# EAGLE schematic growmat_easy (EAGLE 7.5.0)

## Sheet 1 of 2
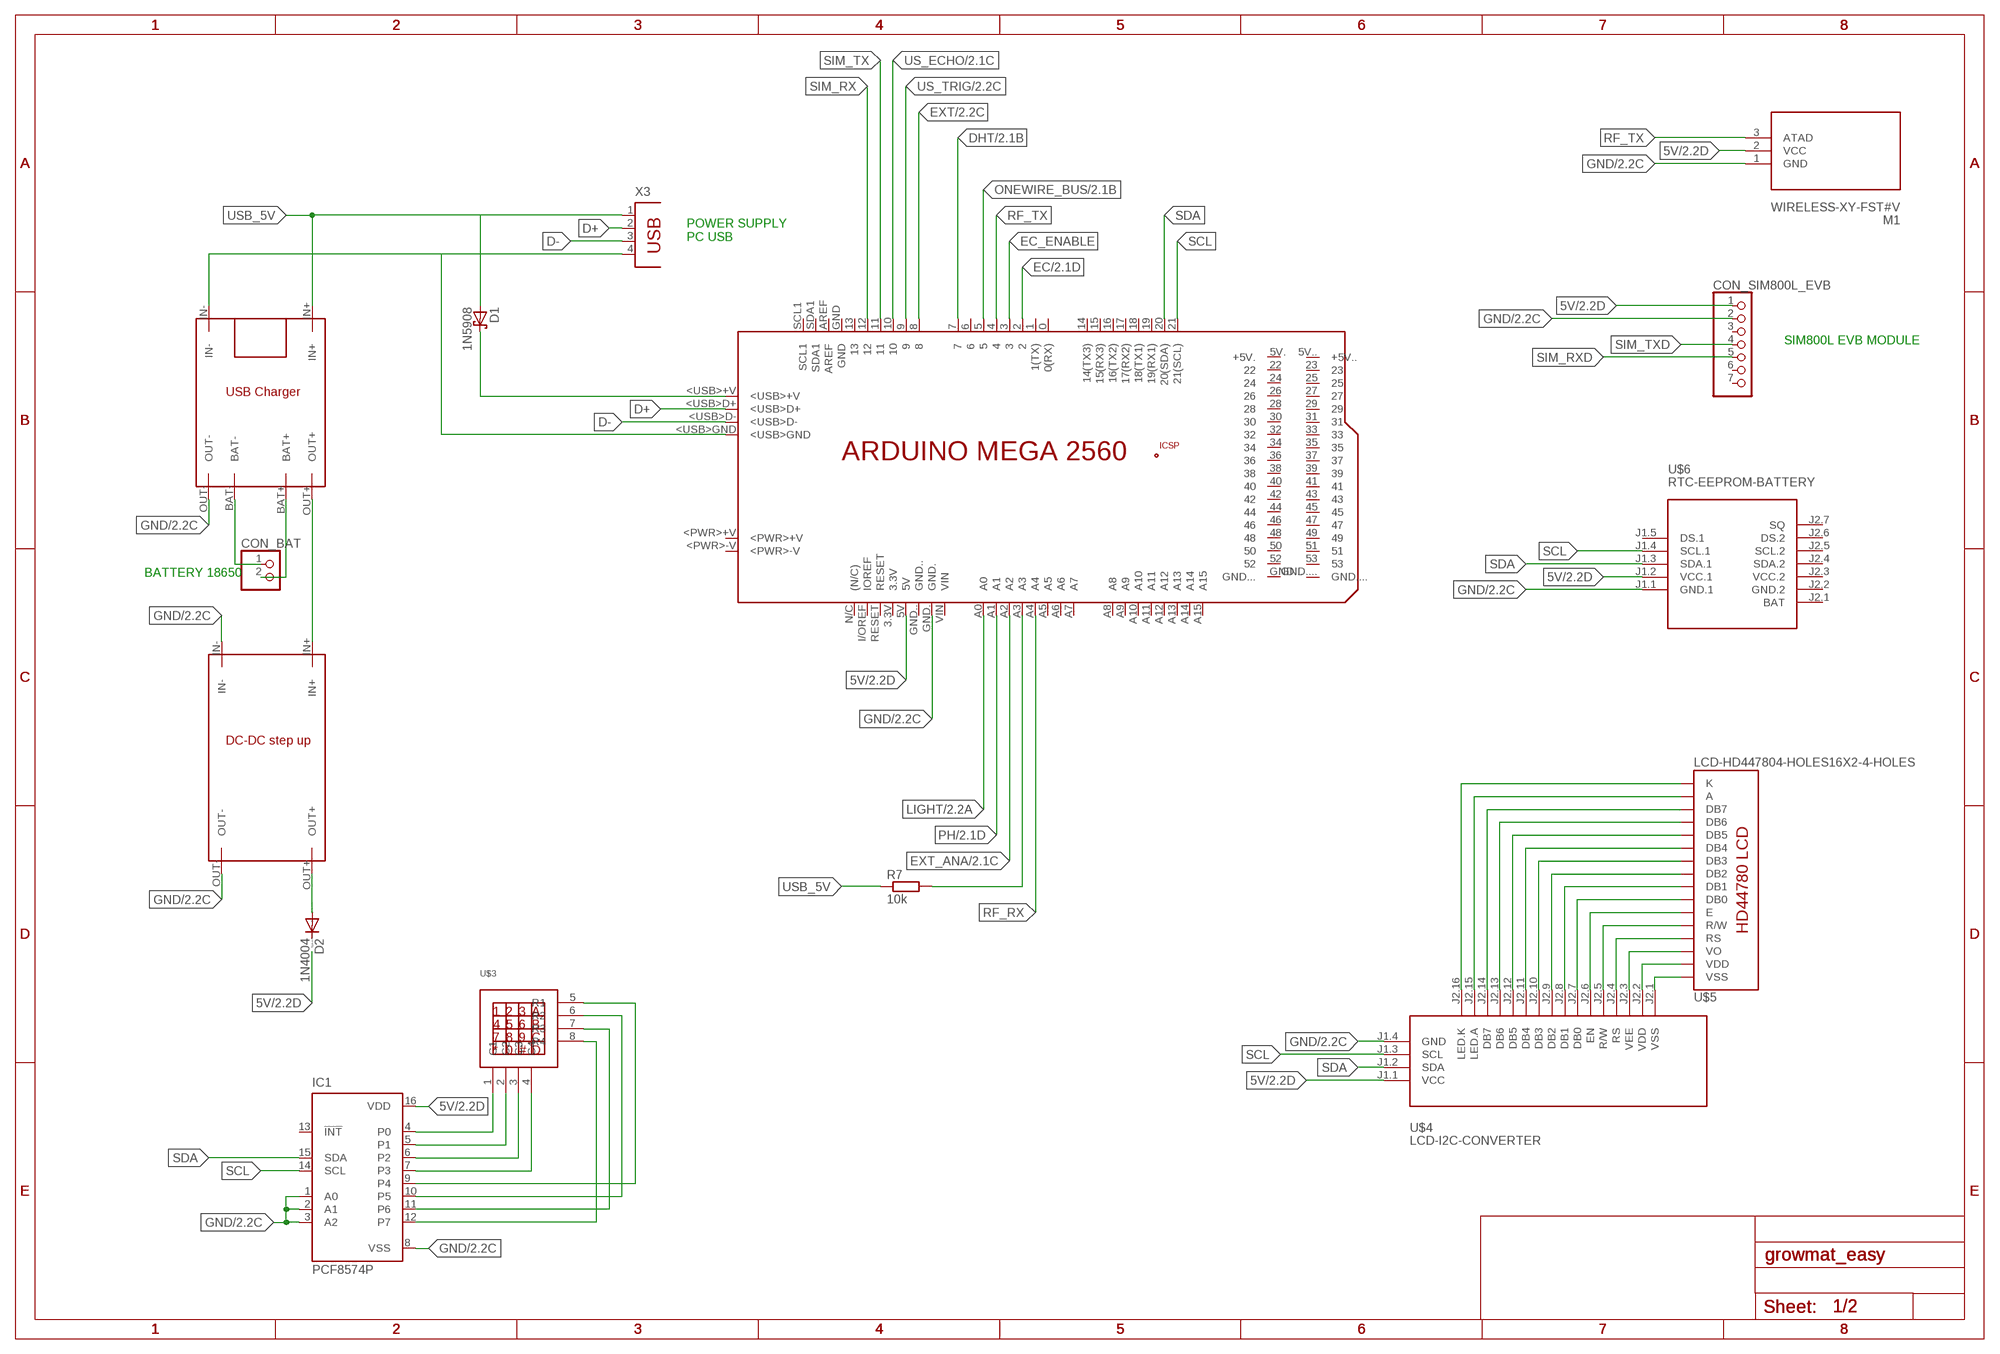
[diagram p0: schematic, sheet 1]

### Parts
CON_BAT  PINHD-1X2  [1X02]
CON_SIM800L_EVB  PINHD-1X7  [1X07]
D1  1N5908  [C4111-15]
D2  1N4004  [DO41-10]
IC1  PCF8574P  [DIL16]
M1  WIRELESS-XY-FST#V  [WIRELESS-XY-FST#V]
PCB1  ARDUINO_MEGA2560  [ARDUINO_MEGA2560]
R7  10k  R-EU_0309/12  [0309/12]
U$1  TP4056  [TP4056]
U$2  DC-DC_STEPUP  [DC-DC_STEPUP]
U$3  KEYPAD4X4  [KEYPAD4X4]
U$4  LCD-I2C-CONVERTER  [LCD-I2C-CONVERTER]
U$5  LCD-HD447804-HOLES16X2-4-HOLES  [LCD-16X2-4HOLES]
U$6  RTC-EEPROM-BATTERY  [RTC_EEPROM_BATTERY]
X3  PN61729  [PN61729]

### Nets
5V: CON_SIM800L_EVB.1 IC1.16(VDD) M1.2(VCC) PCB1.5V U$4.J1.1(VCC) U$6.J1.2(VCC.1) ; also sheet 2
BAT+: CON_BAT.2 U$1.BAT+
BAT-: CON_BAT.1 U$1.BAT-
D+: PCB1.<USB>D+ X3.2
D-: PCB1.<USB>D- X3.3
DHT: PCB1.7 ; also sheet 2
EC: PCB1.2 ; also sheet 2
EC_ENABLE: PCB1.3
EXT: PCB1.8 ; also sheet 2
EXT_ANA: PCB1.A2 ; also sheet 2
GND: CON_SIM800L_EVB.2 IC1.1(A0) IC1.2(A1) IC1.3(A2) IC1.8(VSS) M1.1(GND) PCB1.GND. U$1.OUT- U$2.IN- U$2.OUT- U$4.J1.4(GND) U$6.J1.1(GND.1) ; also sheet 2
LIGHT: PCB1.A0 ; also sheet 2
N$1: U$1.OUT+ U$2.IN+
N$2: PCB1.<USB>GND U$1.IN- X3.4
N$3: IC1.4(P0) U$3.1(C1)
N$4: IC1.5(P1) U$3.2(C2)
N$6: IC1.6(P2) U$3.3(C3)
N$7: D1.C PCB1.<USB>+V
N$8: IC1.7(P3) U$3.4(C4)
N$9: IC1.9(P4) U$3.5(R1)
N$10: IC1.10(P5) U$3.6(R2)
N$11: IC1.11(P6) U$3.7(R3)
N$12: IC1.12(P7) U$3.8(R4)
N$13: U$4.J2.1(VSS) U$5.1(VSS)
N$14: U$4.J2.2(VDD) U$5.2(VDD)
N$15: U$4.J2.3(VEE) U$5.3(VO)
N$16: U$4.J2.4(RS) U$5.4(RS)
N$17: U$4.J2.5(R/W) U$5.5(R/W)
N$18: U$4.J2.6(EN) U$5.6(E)
N$19: U$4.J2.7(DB0) U$5.7(DB0)
N$20: U$4.J2.8(DB1) U$5.8(DB1)
N$21: U$4.J2.9(DB2) U$5.9(DB2)
N$22: U$4.J2.10(DB3) U$5.10(DB3)
N$23: U$4.J2.11(DB4) U$5.11(DB4)
N$24: U$4.J2.12(DB5) U$5.12(DB5)
N$25: U$4.J2.13(DB6) U$5.13(DB6)
N$26: U$4.J2.14(DB7) U$5.14(DB7)
N$27: U$4.J2.15(LED.A) U$5.15(A)
N$28: U$4.J2.16(LED.K) U$5.16(K)
N$35: PCB1.A3 R7.2
N$36: D2.A U$2.OUT+
ONEWIRE_BUS: PCB1.5 ; also sheet 2
PH: PCB1.A1 ; also sheet 2
RF_RX: PCB1.A4
RF_TX: M1.3(ATAD) PCB1.4
SCL: IC1.14(SCL) PCB1.21(21(SCL)) U$4.J1.3(SCL) U$6.J1.4(SCL.1)
SDA: IC1.15(SDA) PCB1.20(20(SDA)) U$4.J1.2(SDA) U$6.J1.3(SDA.1)
SIM_RX: PCB1.12
SIM_RXD: CON_SIM800L_EVB.5
SIM_TX: PCB1.11
SIM_TXD: CON_SIM800L_EVB.4
US_ECHO: PCB1.10 ; also sheet 2
US_TRIG: PCB1.9 ; also sheet 2
USB_5V: D1.A R7.1 U$1.IN+ X3.1
Unconnected: CON_SIM800L_EVB.3 CON_SIM800L_EVB.6 CON_SIM800L_EVB.7 D2.C IC1.13(!INT) PCB1.0(0(RX)) PCB1.1(1(TX)) PCB1.3.3V PCB1.5V.(+5V.) PCB1.5V..(+5V..) PCB1.6 PCB1.13 PCB1.14(14(TX3)) PCB1.15(15(RX3)) PCB1.16(16(TX2)) PCB1.17(17(RX2)) PCB1.18(18(TX1)) PCB1.19(19(RX1)) PCB1.22 PCB1.23 PCB1.24 PCB1.25 PCB1.26 PCB1.27 PCB1.28 PCB1.29 PCB1.30 PCB1.31 PCB1.32 PCB1.33 PCB1.34 PCB1.35 PCB1.36 PCB1.37 PCB1.38 PCB1.39 PCB1.40 PCB1.41 PCB1.42 PCB1.43 PCB1.44 PCB1.45 PCB1.46 PCB1.47 PCB1.48 PCB1.49 PCB1.50 PCB1.51 PCB1.52 PCB1.53 PCB1.+5V_ PCB1.<PWR>+V PCB1.<PWR>-V PCB1.A5 PCB1.A6 PCB1.A7 PCB1.A8 PCB1.A9 PCB1.A10 PCB1.A11 PCB1.A12 PCB1.A13 PCB1.A14 PCB1.A15 PCB1.AREF PCB1.GND PCB1.GND.. PCB1.GND... PCB1.GND.... PCB1.GND__ PCB1.I/OREF(IOREF) PCB1.MISO PCB1.MOSI PCB1.N/C((N/C)) PCB1.RESET PCB1.RESET. PCB1.SCK PCB1.SCL1 PCB1.SDA1 PCB1.VIN U$6.J1.5(DS.1) U$6.J2.1(BAT) U$6.J2.4(SDA.2) U$6.J2.5(SCL.2) U$6.J2.6(DS.2) U$6.J2.7(SQ)

### Notes on the sheet
- POWER SUPPLY
  PC USB
- SIM800L EVB MODULE
- BATTERY 18650

## Sheet 2 of 2
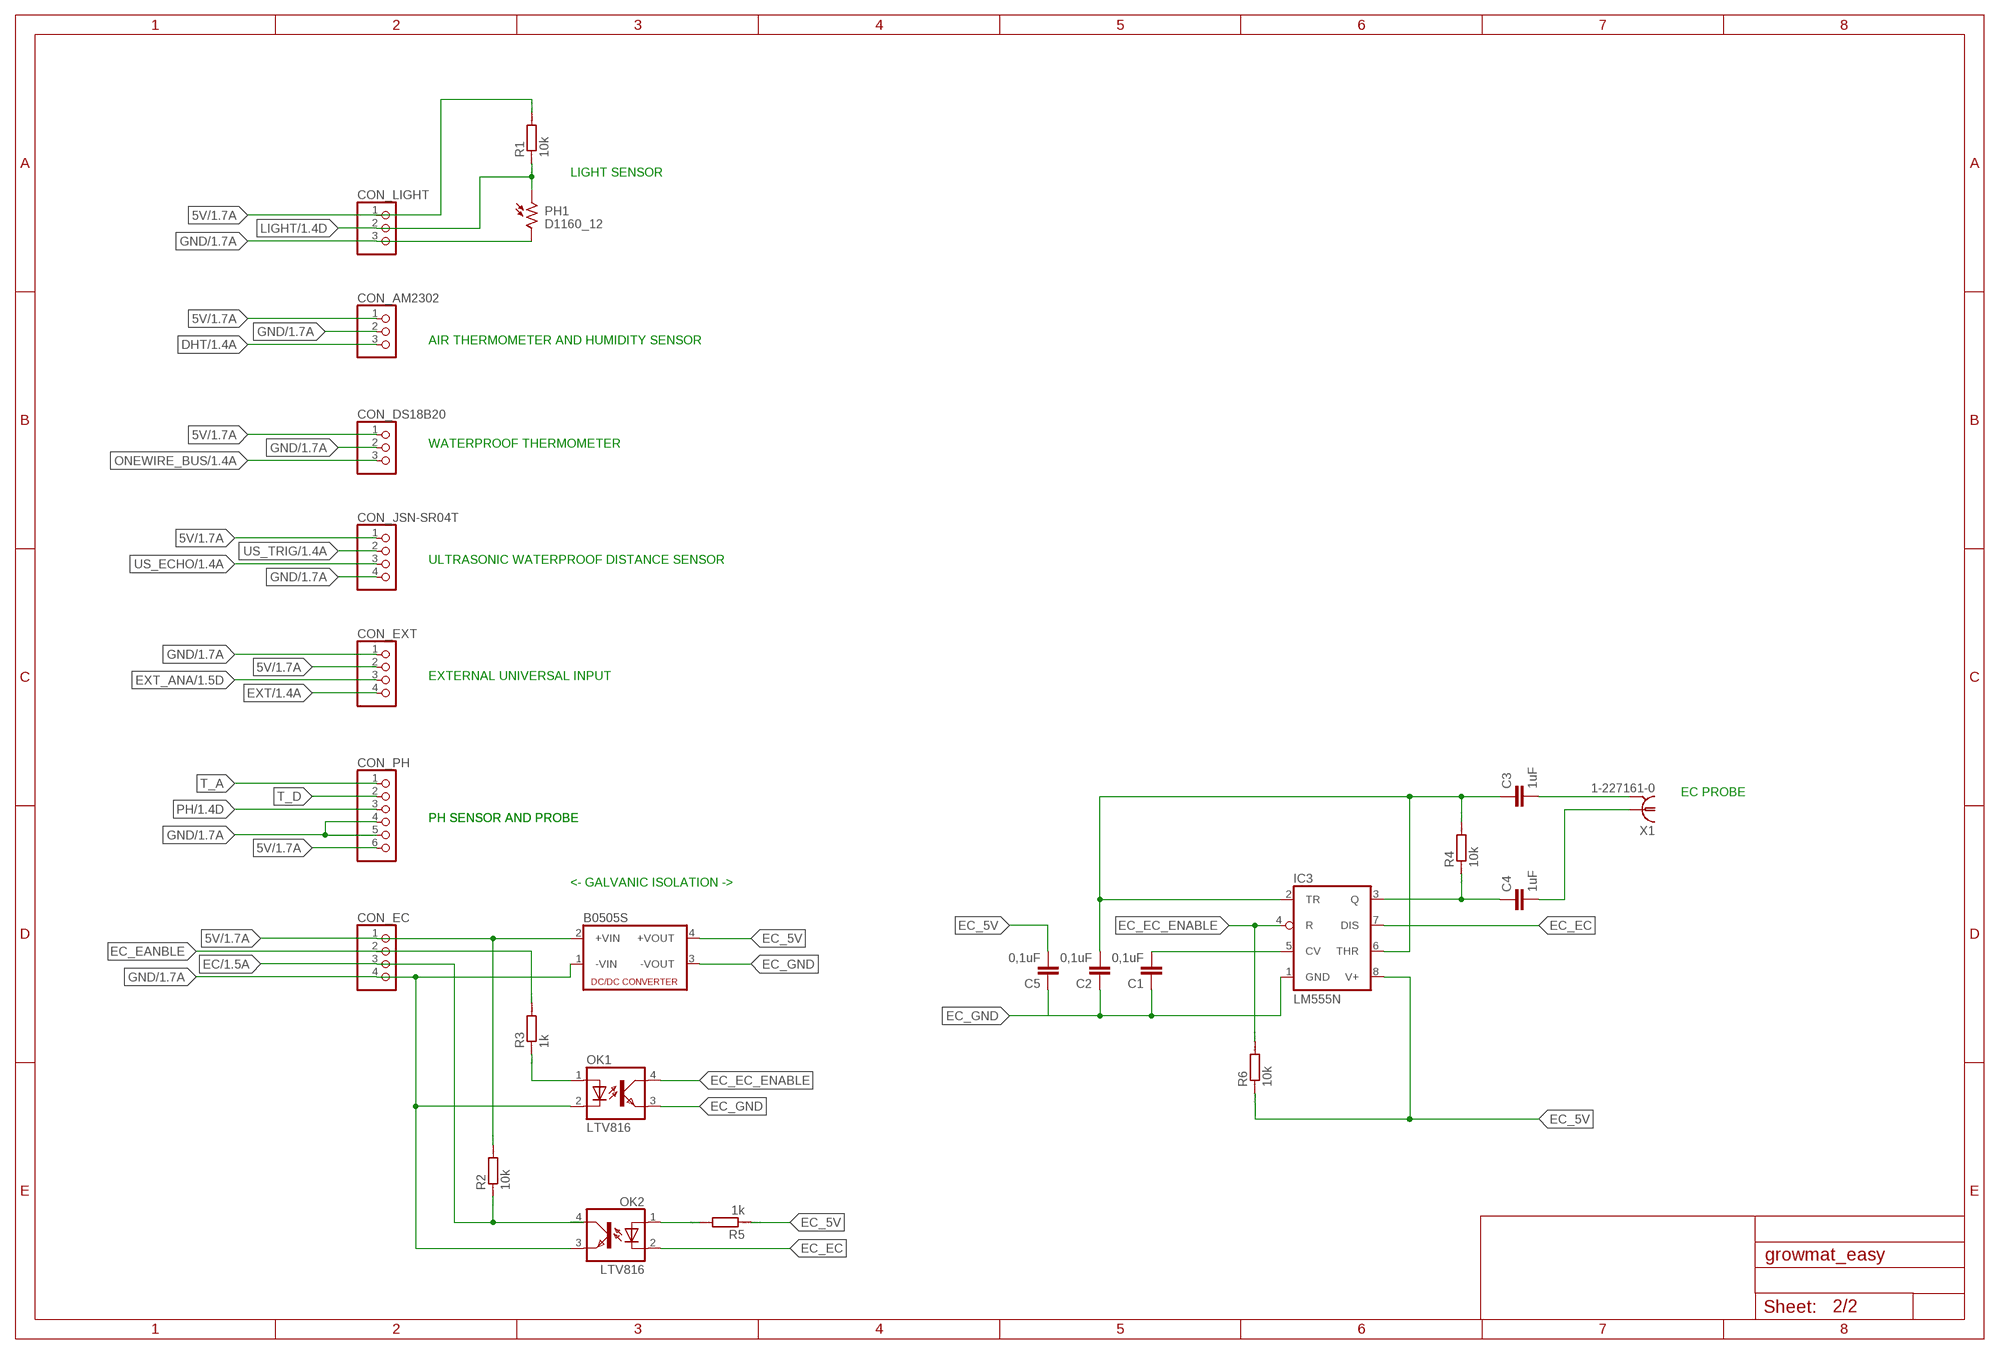
[diagram p1: schematic, sheet 2]

### Parts
B0505S  NME  [NME]
C1  0,1uF  C-EU050-024X044  [C050-024X044]
C2  0,1uF  C-EU050-024X044  [C050-024X044]
C3  1uF  C-EU050-024X044  [C050-024X044]
C4  1uF  C-EU050-024X044  [C050-024X044]
C5  0,1uF  C-EU050-024X044  [C050-024X044]
CON_AM2302  PINHD-1X3  [1X03]
CON_DS18B20  PINHD-1X3  [1X03]
CON_EC  PINHD-1X4  [1X04]
CON_EXT  PINHD-1X4  [1X04]
CON_JSN-SR04T  PINHD-1X4  [1X04]
CON_LIGHT  PINHD-1X3  [1X03]
CON_PH  PINHD-1X6  [1X06]
IC3  LM555N  [DIL08]
OK1  LTV816  [DIL04]
OK2  LTV816  [DIL04]
PH1  D1160_12  [D11XX]
R1  10k  R0207/10  [0207/10]
R2  10k  R0207/10  [0207/10]
R3  1k  R0207/10  [0207/10]
R4  10k  R0207/10  [0207/10]
R5  1k  R0207/10  [0207/10]
R6  10k  R0207/10  [0207/10]
X1  1-227161-0  [AMP_227161]

### Nets
5V: B0505S.2(+VIN) CON_AM2302.1 CON_DS18B20.1 CON_EC.1 CON_EXT.2 CON_JSN-SR04T.1 CON_PH.6 R1.2 R2.2 ; also sheet 1
DHT: CON_AM2302.3 ; also sheet 1
EC: CON_EC.3 OK2.4(COL) R2.1 ; also sheet 1
EC_5V: B0505S.4(+VOUT) C5.2 IC3.8(V+) R5.1 R6.1
EC_EANBLE: CON_EC.2 R3.2
EC_EC: IC3.7(DIS) OK2.2(C)
EC_EC_ENABLE: IC3.4(R) OK1.4(COL) R6.2
EC_GND: B0505S.3(-VOUT) C1.1 C2.1 C5.1 IC3.1(GND) OK1.3(EMIT)
EXT: CON_EXT.4 ; also sheet 1
EXT_ANA: CON_EXT.3 ; also sheet 1
GND: B0505S.1(-VIN) CON_AM2302.2 CON_DS18B20.2 CON_EC.4 CON_EXT.1 CON_JSN-SR04T.4 CON_LIGHT.3 CON_PH.4 CON_PH.5 OK1.2(C) OK2.3(EMIT) PH1.2 ; also sheet 1
LIGHT: CON_LIGHT.2 PH1.1 R1.1 ; also sheet 1
N$5: C1.2 IC3.5(CV)
N$29: C3.2 X1.2
N$30: C2.2 C3.1 IC3.2(TR) IC3.6(THR) R4.2
N$31: OK1.1(A) R3.1
N$32: C4.1 IC3.3(Q) R4.1
N$33: OK2.1(A) R5.2
N$34: C4.2 X1.1
ONEWIRE_BUS: CON_DS18B20.3 ; also sheet 1
PH: CON_PH.3 ; also sheet 1
T_A: CON_PH.1
T_D: CON_PH.2
US_ECHO: CON_JSN-SR04T.3 ; also sheet 1
US_TRIG: CON_JSN-SR04T.2 ; also sheet 1
Unconnected: CON_LIGHT.1

### Notes on the sheet
- LIGHT SENSOR
- AIR THERMOMETER AND HUMIDITY SENSOR
- WATERPROOF THERMOMETER
- ULTRASONIC WATERPROOF DISTANCE SENSOR
- EXTERNAL UNIVERSAL INPUT
- EC PROBE
- PH SENSOR AND PROBE | PH SENSOR AND PROBE
- <- GALVANIC ISOLATION ->

## Power pins joined to a net without a drawn wire
GND.2: U$6.J2.2(GND.2)
VCC.2: U$6.J2.3(VCC.2)

## Library data of the parts
B0505S = dc-dc-converter:NME: DC-DC CONVERTER; MF: C & D TECHNOLOGIES, INC; MPN: NME1205D; OC_FARNELL: 1021466; OC_NEWARK: 98B8198
C1-C5 = rcl:C-EU: CAPACITOR, European symbol
CON_AM2302 CON_DS18B20 CON_LIGHT = pinhead:PINHD-1X3: PIN HEADER
CON_BAT = pinhead:PINHD-1X2: PIN HEADER
CON_EC CON_EXT CON_JSN-SR04T = pinhead:PINHD-1X4: PIN HEADER
CON_PH = pinhead:PINHD-1X6: PIN HEADER
CON_SIM800L_EVB = pinhead:PINHD-1X7: PIN HEADER
D1 = diode:1N5908: DIODE schottky
D2 = diode:1N4004: DIODE general purpose rectifier, 1 A
IC1 = micro-philips:PCF8574: I2C-Bus Remote 8-bit I/O expander http://www.semiconductors.philips.com/acrobat_download/datasheets/PCF8574_4.pdf; MPN: PCF8574PN; OC_FARNELL: 204020; OC_NEWARK: 11N8515
IC3 = linear:*555: TIMER
M1 = diy-modules:WIRELESS-XY-FST#V: RF Wireless XY-FST Transmitter vertically mounted
OK1 OK2 = optocoupler:LTV816: OPTO COUPLER Source: LITEON, LTV816.pdf; OC_FARNELL: unknown; OC_NEWARK: unknown
PCB1 = E14_Arduino_revC:ARDUINO_MEGA2560: Device for representing an Arduino Mega 2560 board with a footprint in an EAGLE design. Created by Dave Young for Element14. More EAGLE documentation at: http://www.element14.com/community/community/knode/cadsoft_eagle
PH1 = photo-elements:D11: Photo Sensor Oil Burner Control Applications Source: http://optoelectronics.perkinelmer.com/content/Datasheets/DTS_PhotocellsD1160.pdf
R1-R6 = eagle-ltspice:R: RESISTOR, European symbol; SPICEMODEL: NONE; SPICEPREFIX: R
R7 = resistor:R-EU_: RESISTOR, European symbol
U$1 = TP4056 charging module with protection:TP4056
U$2 = DC-DC step up:DC-DC_STEPUP
U$3 = keypad_4x4_raw:KEYPAD4X4
U$4 = diy-modules:LCD-I2C-CONVERTER: I2C Bus to 4-Bit Parallel LCD Interface with LED backlight driver
U$5 = HD44780LCD:LCD-HD44780
U$6 = diy-modules:RTC-EEPROM-BATTERY: RTC Module with Battery and EEPROM based on DS1307 and AT24C32 chips
X1 = con-coax:?227161*: JACK, RIGHT ANGLE, 50 OHM, PCB, BNC Source: amp_227161.pdf; MF: TYCO ELECTRONICS; MPN: 1-227161; OC_FARNELL: unknown; OC_NEWARK: 33B3200
X3 = con-berg:PN61729: BERG USB connector; OC_FARNELL: unknown; OC_NEWARK: unknown